# Altium schematic sheet EYSGJNZWY1_EYSGJNZWY.schdoc
size 127 x 99 mm
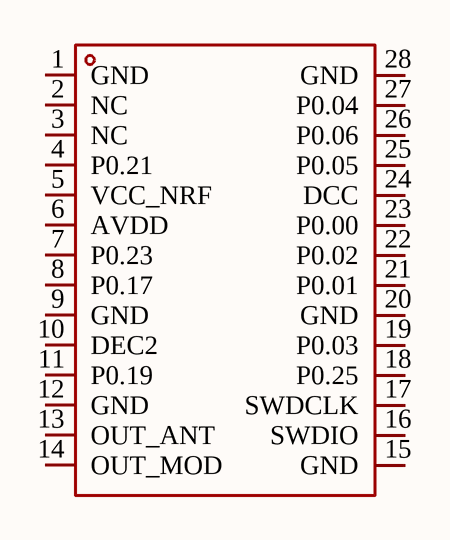
[diagram p0: EYSGJNZWY1_EYSGJNZWY.schdoc]

## Parts
U?  EYSGJNZWY  [WIRELM-SMD_EYSGJNAWY-WX]  (value not drawn)

## Nets

Not connected (* = marked no-connect by the designer): U? 1(GND) 2(NC) 3(NC) 4(P0.21) 5(VCC_NRF) 6(AVDD) 7(P0.23) 8(P0.17) 9(GND) 10(DEC2) 11(P0.19) 12(GND) 13(OUT_ANT) 14(OUT_MOD) 15(GND) 16(SWDIO) 17(SWDCLK) 18(P0.25) 19(P0.03) 20(GND) 21(P0.01) 22(P0.02) 23(P0.00) 24(DCC) 25(P0.05) 26(P0.06) 27(P0.04) 28(GND)

## Library data of the parts
U? = EYSGJNZWY: Manufacturer: TAIYO YUDEN(太诱); Add into BOM: yes; Symbol: EYSGJNZWY; Device: EYSGJNZWY; LCSC Part Name: EYSGJNZWY; Supplier Part: C2151959; Manufacturer Part: EYSGJNZWY; Supplier Footprint: SMD-28P; JLCPCB Part Class: Extended Part; Datasheet: https://atta.szlcsc.com/upload/public/pdf/source/20210505/60A1B5BDDC2D0BDDFF432CCACC8543B8.pdf; Supplier: LCSC; Convert to PCB: yes